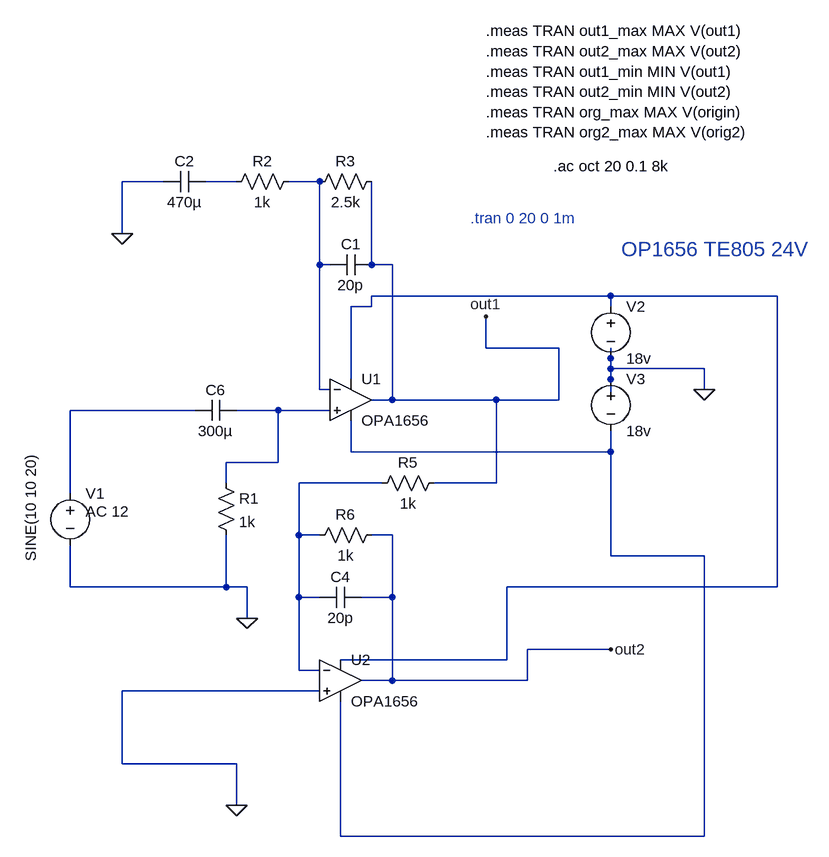
[diagram p0: schematic opa1656_te805_sim.asc]
opa1656_te805_sim.asc, the LTspice schematic file:
Version 4.1
SHEET 1 880 852
WIRE -320 -160 -384 -160
WIRE -208 -160 -256 -160
WIRE -80 -160 -128 -160
WIRE -384 -80 -384 -160
WIRE -80 -32 -80 -160
WIRE -64 -32 -80 -32
WIRE 0 -32 0 -160
WIRE 32 -32 0 -32
WIRE 368 16 0 16
WIRE 624 16 368 16
WIRE 0 32 0 16
WIRE 0 32 -32 32
WIRE 368 32 368 16
WIRE 176 96 176 48
WIRE 288 96 176 96
WIRE 368 112 368 96
WIRE 368 128 368 112
WIRE 512 128 368 128
WIRE -32 144 -32 32
WIRE 368 144 368 128
WIRE -80 160 -80 -32
WIRE -64 160 -80 160
WIRE 512 160 512 128
WIRE 32 176 32 -32
WIRE 32 176 0 176
WIRE 192 176 32 176
WIRE 288 176 288 96
WIRE 288 176 192 176
WIRE 368 176 368 144
WIRE -272 192 -464 192
WIRE -144 192 -208 192
WIRE -64 192 -144 192
WIRE -32 256 -32 208
WIRE 368 256 368 224
WIRE 368 256 -32 256
WIRE -144 272 -144 192
WIRE -144 272 -224 272
WIRE -224 304 -224 272
WIRE 16 304 -112 304
WIRE 192 304 192 176
WIRE 192 304 96 304
WIRE -464 320 -464 192
WIRE -112 384 -112 304
WIRE -80 384 -112 384
WIRE 32 384 0 384
WIRE 368 416 368 256
WIRE 512 416 368 416
WIRE -464 464 -464 400
WIRE -224 464 -224 384
WIRE -224 464 -464 464
WIRE -192 464 -224 464
WIRE 624 464 624 16
WIRE 624 464 208 464
WIRE -112 480 -112 384
WIRE -80 480 -112 480
WIRE 32 480 32 384
WIRE 32 480 -16 480
WIRE -192 512 -192 464
WIRE 368 560 240 560
WIRE 208 576 208 464
WIRE 208 576 -48 576
WIRE -112 592 -112 480
WIRE -80 592 -112 592
WIRE 32 608 32 480
WIRE 32 608 -16 608
WIRE 240 608 240 560
WIRE 240 608 32 608
WIRE -80 624 -384 624
WIRE -384 736 -384 624
WIRE -208 736 -384 736
WIRE -208 800 -208 736
WIRE -48 848 -48 640
WIRE 512 848 512 416
WIRE 512 848 -48 848
FLAG -192 512 0
FLAG 176 48 out1
FLAG -384 -80 0
FLAG 512 160 0
FLAG 368 560 out2
FLAG -208 800 0
SYMBOL voltage -464 304 R0
WINDOW 123 24 44 Left 2
WINDOW 39 0 0 Left 0
WINDOW 3 -45 38 VBottom 2
SYMATTR Value2 AC 12
SYMATTR Value SINE(10 10 20)
SYMATTR InstName V1
SYMBOL voltage 368 16 R0
WINDOW 123 0 0 Left 0
WINDOW 39 0 0 Left 0
SYMATTR InstName V2
SYMATTR Value 18v
SYMBOL voltage 368 128 R0
WINDOW 123 0 0 Left 0
WINDOW 39 0 0 Left 0
SYMATTR InstName V3
SYMATTR Value 18v
SYMBOL OPA1656\\OPA1656 -32 112 R0
SYMATTR InstName U1
SYMBOL cap 0 -48 R90
WINDOW 0 0 32 VBottom 2
WINDOW 3 32 32 VTop 2
SYMATTR InstName C1
SYMATTR Value 20p
SYMBOL cap -256 -176 R90
WINDOW 0 0 32 VBottom 2
WINDOW 3 32 32 VTop 2
SYMATTR InstName C2
SYMATTR Value 470µ
SYMBOL res -112 -176 R90
WINDOW 0 0 56 VBottom 2
WINDOW 3 32 56 VTop 2
SYMATTR InstName R2
SYMATTR Value 1k
SYMBOL res 16 -176 R90
WINDOW 0 0 56 VBottom 2
WINDOW 3 32 56 VTop 2
SYMATTR InstName R3
SYMATTR Value 2.5k
SYMBOL OPA1656\\OPA1656 -48 544 R0
SYMATTR InstName U2
SYMBOL cap -16 464 R90
WINDOW 0 0 32 VBottom 2
WINDOW 3 32 32 VTop 2
SYMATTR InstName C4
SYMATTR Value 20p
SYMBOL res 16 368 R90
WINDOW 0 0 56 VBottom 2
WINDOW 3 32 56 VTop 2
SYMATTR InstName R6
SYMATTR Value 1k
SYMBOL res 112 288 R90
WINDOW 0 0 56 VBottom 2
WINDOW 3 32 56 VTop 2
SYMATTR InstName R5
SYMATTR Value 1k
SYMBOL cap -208 176 R90
WINDOW 0 0 32 VBottom 2
WINDOW 3 32 32 VTop 2
SYMATTR InstName C6
SYMATTR Value 300µ
SYMBOL res -240 288 R0
SYMATTR InstName R1
SYMATTR Value 1k
TEXT 152 -104 Left 2 ;.tran 0 20 0 1m
TEXT 384 -56 Left 3 ;OP1656 TE805 24V
TEXT 280 -184 Left 2 !.ac oct 20 0.1 8k
TEXT 176 -392 Left 2 !.meas TRAN out1_max MAX V(out1)\n.meas TRAN out2_max MAX V(out2)\n.meas TRAN out1_min MIN V(out1)\n.meas TRAN out2_min MIN V(out2)\n.meas TRAN org_max MAX V(origin)\n.meas TRAN org2_max MAX V(orig2)

The netlist it stands for:
* opa1656_te805_sim.asc
V1 N004 0 SINE(10 10 20) AC 12
V2 N003 0 18v
V3 0 N006 18v
* U1: OPA1656 (symbol OPA1656\OPA1656 not available, pins judged from their places): In+=N005 In-=N002 V+=N003 V-=N006 OUT=out1
C1 out1 N002 20p
C2 N001 0 470µ
R2 N002 N001 1k
R3 out1 N002 2.5k
* U2: OPA1656 (symbol OPA1656\OPA1656 not available, pins judged from their places): In+=0 In-=N007 V+=N003 V-=N006 OUT=out2
C4 out2 N007 20p
R6 out2 N007 1k
R5 out1 N007 1k
C6 N005 N004 300µ
R1 N005 0 1k
* .tran 0 20 0 1m
* OP1656 TE805 24V
.ac oct 20 0.1 8k
.meas TRAN out1_max MAX V(out1)
.meas TRAN out2_max MAX V(out2)
.meas TRAN out1_min MIN V(out1)
.meas TRAN out2_min MIN V(out2)
.meas TRAN org_max MAX V(origin)
.meas TRAN org2_max MAX V(orig2)
.backanno
.end